# Altium schematic sheet 5_spiFlash.SchDoc
size A4
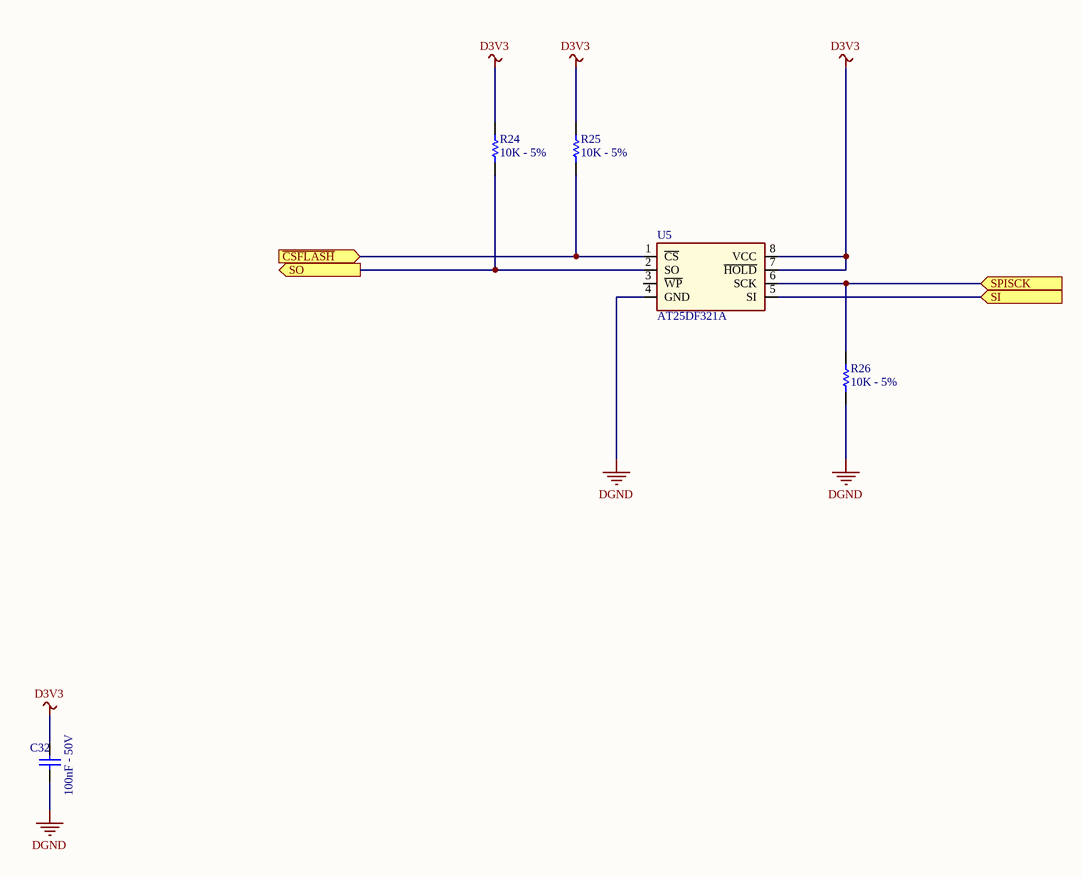
[diagram p0: 5_spiFlash.SchDoc]

## Parts
C32  VALOR: 100nF - 50V  [SMD0805-CAP]  (hidden comment: Capacitor 100 nF - 10%)
R24  VALOR: 10K - 5%  [SMD0805]  (hidden comment: 10K - 5% - 0805 - 328)
R25  VALOR: 10K - 5%  [SMD0805]  (hidden comment: 10K - 5% - 0805 - 328)
R26  VALOR: 10K - 5%  [SMD0805]  (hidden comment: 10K - 5% - 0805 - 328)
U5  VALOR: AT25DF321A  [BIQUAD.SOG.050/8/WG.325/L.200]  (hidden comment: AT25DF321A (EIAJ SOIC) 5219)

## Ports
SI (in), SO (out), SPISCK (in), ~{CSFLASH} (in)

## Nets
D3V3: C32.1 R24.2 R25.2 U5.7(~{HOLD}) U5.8(VCC)
DGND: C32.2 R26.1 U5.4(GND)
~{CSFLASH}: R25.1 U5.1(~{CS}) ; port ~{CSFLASH}
SI: U5.5(SI) ; port SI
SO: R24.1 U5.2(SO) ; port SO
SPISCK: R26.2 U5.6(SCK) ; port SPISCK

Not connected (* = marked no-connect by the designer): U5 3(~{WP})

## Library data of the parts
C32 = 100nF - 50V - 10% - 0805 - 580: Capacitor 100nF, 10%, SMD 0805; MANUFACTURER: AVX; PARTNUMBER: 08055C104KAT2A; CODIGO: 580; EMBALAGEM: REEL; FORNECEDOR: VARIOS; DESC: CAP 100nF, 50V, SMD0805, 10%, X7R, CERAMICO MULTICAMADA; TARGET MÁX U$: $0,0041; ComponentLink1Description: Datasheet; ComponentLink1URL: http://www.avx.com/docs/catalogs/cx7r.pdf; ComponentLink2Description: HOME AVX; ComponentLink2URL: http://www.avx.com/; ENCAPSULAMENTO: SMD0805; FACTORY PACK: 4000; LOCALIZAÇÃO: *; Supplier 1: Mouser; Supplier Part Number 1: 08055C104KAT2A; NCM: 8532.21.11
R24-R26 = 10K - 5% - 0805 - 328: Resistor 10K, 5%, SMD 0805; PARTNUMBER: RC2012J103CS; MANUFACTURER: SAMSUNG; CODIGO: 328; EMBALAGEM: REEL; FORNECEDOR: VARIOS; DESC: RES 10K, 5%, SMD 0805, MF; TARGET MÁX U$: $0.0012; ENCAPSULAMENTO: SMD0805; FACTORY PACK: 5000; ComponentLink1URL: http://media.digikey.com/pdf/Data%20Sheets/Samsung%20PDFs/CHIP_RESISTOR_Catalog.pdf; ComponentLink1Description: Datasheet; ComponentLink2Description: HOME SANSUNG; ComponentLink2URL: http://www.samsung.com/global/business/semiconductor/; Supplier 1: Digi-Key; Supplier Part Number 1: 1276-5552-1-ND; NCM: 8533.21.20
U5 = AT25DF321A (EIAJ SOIC) 5219: CI AT25DF321A; MANUFACTURER: ATMEL; CODIGO: 5219; DESC: CI, AT25DF321A-SH-T, 32M/2.7V INTERFACE SERIAL FLASH, SOIC-8; EMBALAGEM: REEL; ENCAPSULAMENTO: SOIC8; FORNECEDOR: VARIOS; TARGET MÁX U$: $1,0000; PARTNUMBER: AT25DF321A; Supplier 1: VERICAL; Supplier Part Number 1: AT25DF321A-SH-B; ComponentLink1URL: http://www.mouser.com/ds/2/590/doc3686-219632.pdf; ComponentLinK1Description: Datasheet; ComponentLink2Description: HOME Adesto; ComponentLink2URL: http://www.adestotech.com/; FACTORY PACK: 2000; LOCALIZAÇÃO: *; NCM: 8542.31.20